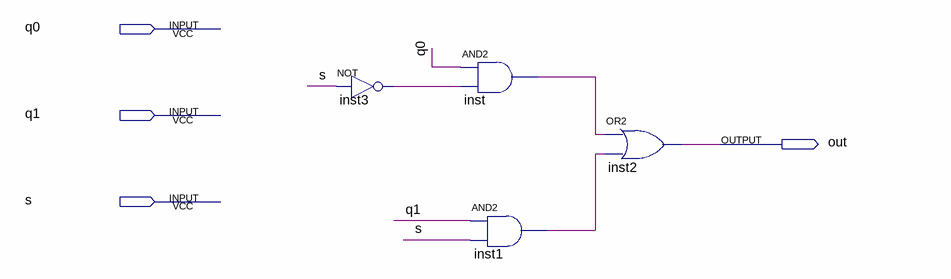
[diagram p0: schematic sheet]
// Quartus schematic MUX.bdf as structural Verilog: 4 symbols, 4 pins
module MUX (
  input  q0,
  input  q1,
  input  s,
  output out
);

  wire inst1_out, inst3_out, inst_out;

  not inst3 (inst3_out, s);
  and inst (inst_out, q0, inst3_out);
  and inst1 (inst1_out, q1, s);
  or inst2 (out, inst_out, inst1_out);
endmodule
